# Altium project PCB_Project1.PrjPCB
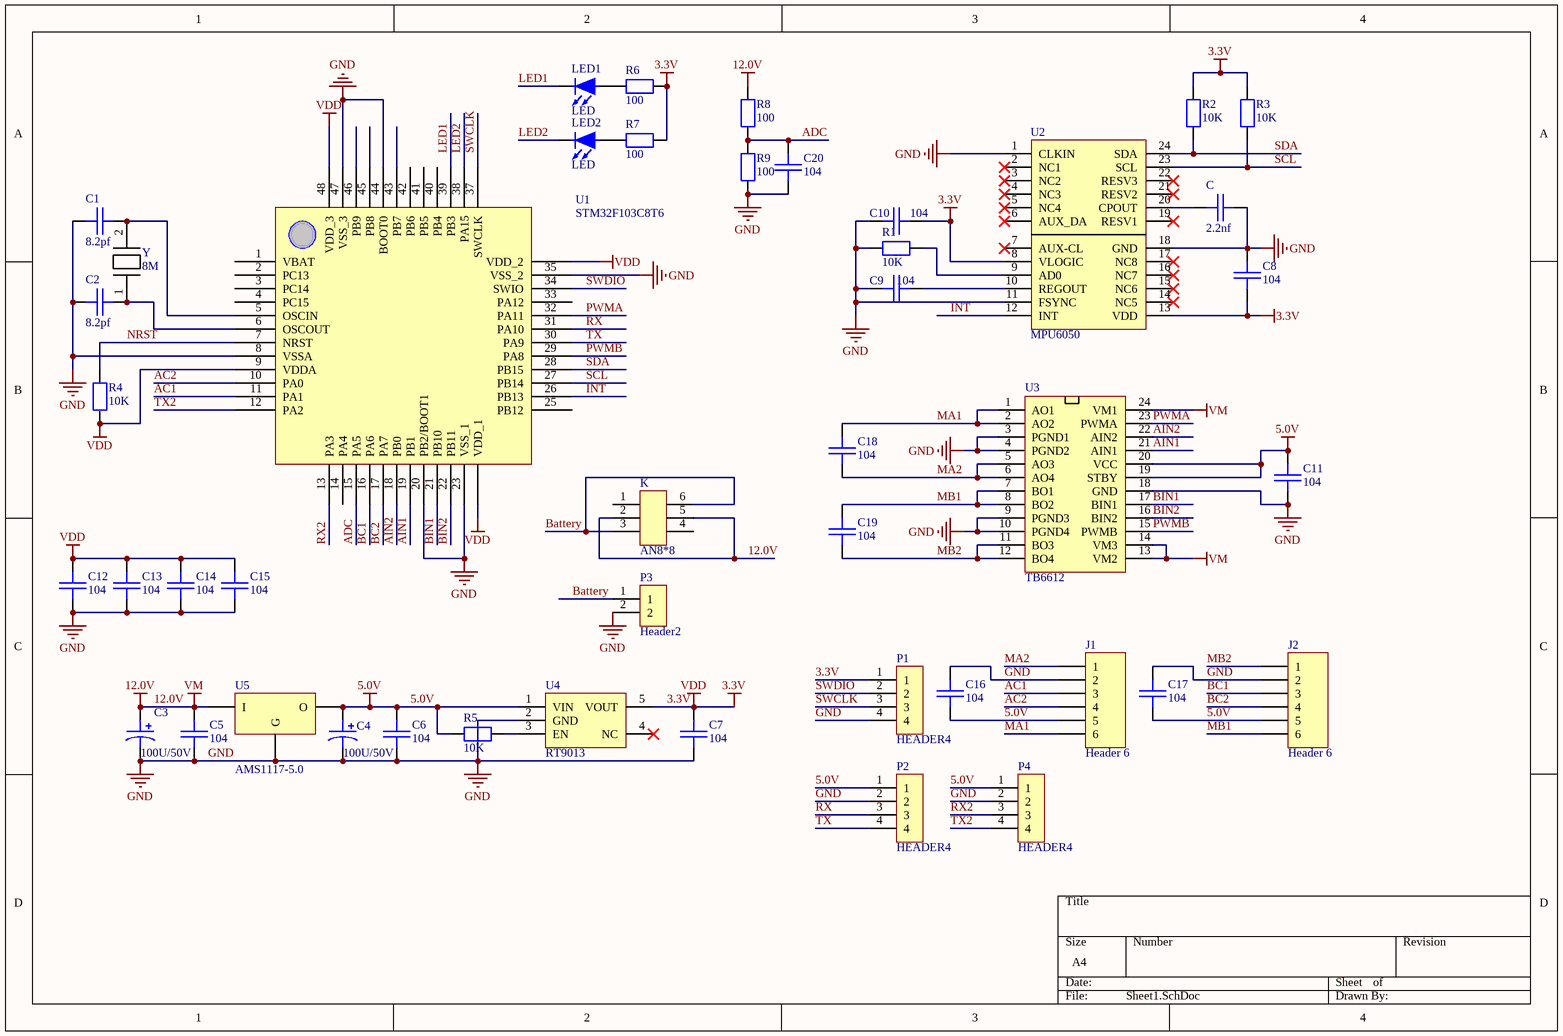
[diagram p0: Sheet1.SchDoc]
1 sheet, 45 parts. Net scope: global (net labels, ports and power ports of the same name join across sheets).
Board file: PCB1.PcbDoc

## Sheet Sheet1.SchDoc
size A4

### Parts
C  2.2nf  [0603]
C1  8.2pf  [0805-C]
C2  8.2pf  [0805-C]
C3  100U/50V  [RB_D8_d3.5]
C4  100U/50V  [RB_D8_d3.5]
C5  104  [0805-C]
C6  104  [0805-C]
C7  104  [0805-C]
C8  104  [0805-C]
C9  104  [0805-C]
C10  104  [0805-C]
C11  104  [0805-C]
C12  104  [0805-C]
C13  104  [0805-C]
C14  104  [0805-C]
C15  104  [0805-C]
C16  104  [0805-C]
C17  104  [0805-C]
C18  104  [0805-C]
C19  104  [0805-C]
C20  104  [0805-C]
J1  Header 6  [HDR1X6]
J2  Header 6  [HDR1X6]
K  AN8*8  [DIP-AN88]
LED1  LED  [LED-0805]
LED2  LED  [LED-0805]
P1  HEADER4  [HDR1X4]
P2  HEADER4  [HDR1X4]
P3  Header2  [HDR1X2]
P4  HEADER4  [HDR1X4]
R1  10K  [0805-R]
R2  10K  [0805-R]
R3  10K  [0805-R]
R4  10K  [0805-R]
R5  10K  [0805-R]
R6  100  [0805-R]
R7  100  [0805-R]
R8  100  [0805-R]
R9  100  [0805-R]
U1  STM32F103C8T6  [LQFP-48]
U2  MPU6050  [QFN-24]
U3  TB6612  [SSOP-24]
U4  RT9013  [SOT-23-5]
U5  AMS1117-5.0  [SOT-223]
Y  8M  [HC-49SMD]

### Nets
3.3V: C7.1 C8.1 C10.1 C12.1 C13.1 C14.1 C15.1 P1.1 R2.2 R3.2 R4.1 R6.2 R7.2 U1.9(VDDA) U1.24(VDD_1) U1.36(VDD_2) U1.48(VDD_3) U2.8(VLOGIC) U2.13(VDD) U4.5(VOUT)  [also labelled VDD]
5.0V: C4.1 C6.1 C11.1 C16.2 C17.2 J1.5 J2.5 P2.1 P4.1 R5.2 U3.19(STBY) U3.20(VCC) U4.1(VIN) U5.2(O)
12.0V: C3.1 C5.1 K.2 K.5 R8.2 U3.13(VM2) U3.14(VM3) U3.24(VM1) U5.3(I)  [also labelled VM]
GND: C.2 C1.2 C2.2 C3.2 C4.2 C5.2 C6.2 C7.2 C8.2 C9.2 C10.2 C11.2 C12.2 C13.2 C14.2 C15.2 C16.1 C17.1 C20.2 J1.2 J2.2 P1.4 P2.2 P3.2 P4.2 R1.1 R9.1 U1.8(VSSA) U1.20(PB2/BOOT1) U1.23(VSS_1) U1.35(VSS_2) U1.44(BOOT0) U1.47(VSS_3) U2.1(CLKIN) U2.11(FSYNC) U2.18(GND) U3.3(PGND1) U3.4(PGND2) U3.9(PGND3) U3.10(PGND4) U3.18(GND) U4.2(GND) U5.1(G)
AC1: J1.3 U1.11(PA1)
AC2: J1.4 U1.10(PA0)
ADC: C20.1 R8.1 R9.2 U1.15(PA5)
AIN1: U1.19(PB1) U3.21(AIN1)
AIN2: U1.18(PB0) U3.22(AIN2)
Battery: K.3 K.6 P3.1
BC1: J2.3 U1.16(PA6)
BC2: J2.4 U1.17(PA7)
BIN1: U1.21(PB10) U3.17(BIN1)
BIN2: U1.22(PB11) U3.16(BIN2)
INT: U1.26(PB13) U2.12(INT)
LED1: LED1.2 U1.39(PB3)
LED2: LED2.2 U1.38(PA15)
MA1: C18.1 J1.6 U3.1(AO1) U3.2(AO2)
MA2: C18.2 J1.1 U3.5(AO3) U3.6(AO4)
MB1: C19.1 J2.6 U3.7(BO1) U3.8(BO2)
MB2: C19.2 J2.1 U3.11(BO3) U3.12(BO4)
NRST: R4.2 U1.7(NRST)
PWMA: U1.32(PA11) U3.23(PWMA)
PWMB: U1.29(PA8) U3.15(PWMB)
RX: P2.3 U1.31(PA10)
RX2: P4.3 U1.13(PA3)
SCL: R3.1 U1.27(PB14) U2.23(SCL)
SDA: R2.1 U1.28(PB15) U2.24(SDA)
SWCLK: P1.3 U1.37(SWCLK)
SWDIO: P1.2 U1.34(SWIO)
TX: P2.4 U1.30(PA9)
TX2: P4.4 U1.12(PA2)
NetC1_1: C1.1 U1.5(OSCIN) Y.2
NetC2_1: C2.1 U1.6(OSCOUT) Y.1
NetC9_1: C9.1 U2.10(REGOUT)
NetC_1: C.1 U2.20(CPOUT)
NetLED1_1: LED1.1 R6.1
NetLED2_1: LED2.1 R7.1
NetR1_2: R1.2 U2.9(AD0)
NetR5_1: R5.1 U4.3(EN)

Not connected (* = marked no-connect by the designer): K 1 4; U1 1(VBAT) 2(PC13) 3(PC14) 4(PC15) 14(PA4) 25(PB12) 33(PA12) 40(PB4) 41(PB5) 42(PB6) 43(PB7) 45(PB8) 46(PB9); U2 2(NC1)* 3(NC2)* 4(NC3)* 5(NC4)* 6(AUX_DA)* 7(AUX-CL)* 14(NC5)* 15(NC6)* 16(NC7)* 17(NC8)* 19(RESV1)* 21(RESV2)* 22(RESV3)*; U4 4(NC)*

### Library data of the parts
C1 C2 C5-C20 = 8.2pf: 制造商: FH(风华); 制造商编号: 0805CG8R2C500NT; 供应商: 立创商城; 链接: http://www.szlcsc.com/so/product/details_2192.html
C3 C4 = 100U/50V: 制造商: CapXon（台湾丰宾）; 供应商: 立创商城
J1 J2 = Header 6: Header, 6-Pin; LatestRevisionDate: 17-Jul-2002; LatestRevisionNote: Re-released for DXP Platform.; Publisher: Altium Limited
LED1 LED2 = LED: 制造商: 国产; 制造商编号: 5AR3UD12; 供应商: 立创商城; 链接: http://www.szlcsc.com/so/product/details_2528.html
R1-R9 = 10K-0805
Y = 晶振 8M